# EasyEDA Pro project CH585M-R1(3)(1)(5).eprj, schematic Schematic1
Board Name: Key; Create Date: 2025-06-08; Page Name: P1; Project Name: CH585M-R1; Schematic Name: Schematic1; Update Date: 2025-06-08; Company: 嘉立创EDA; Page Size: A4; Version: V1.0
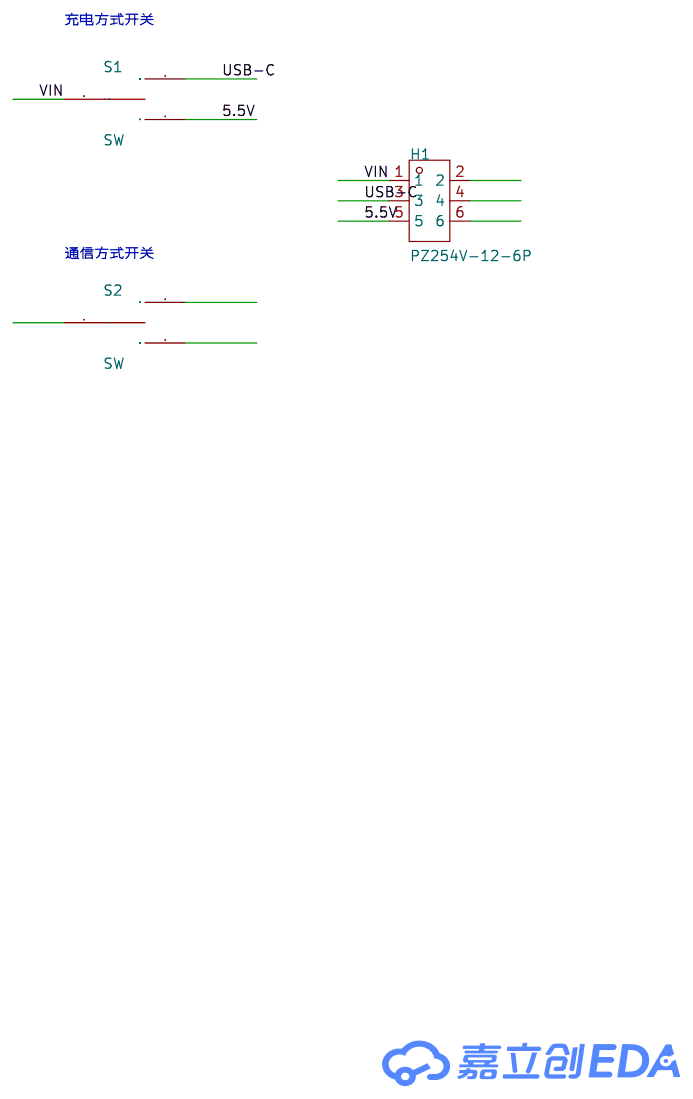
[diagram p2: schematic sheet]

## Parts
H1  PZ254V-12-6P  [HDR-TH_6P-P2.54-V-M-R2-C3-S2.54]
S1  SW  [SW1]
S2  SW  [SW1]

## Library data of the parts
H1 = PZ254V-12-6P: 插针结构:2x3P;间距:2.54mm;行距:2.54mm;圆针/方针:方针;安装类型:直插;排数:双排;总PIN位数:6P;额定电流:-;额定电压:-;配合针长度:6mm;塑高:2.5mm;端接针长度:3mm;触头材质:黄铜;触头镀层:-;工作温度范围:-40℃~+105℃;颜色:黑色;; LCSC Part Name: 间距:2.54mm 2x3P 直插 方针; Supplier Part: C492420; Manufacturer: XFCN(兴飞); Supplier Footprint: 插件,P=2.54mm; JLCPCB Part Class: 扩展库; Datasheet: https://atta.szlcsc.com/upload/public/pdf/source/20200309/C492420_BAECB307B001054C09D200388220EAE6.pdf; Supplier: LCSC; Pin Structure: 2x3P; Pitch: 2.54mm; Row Spacing: 2.54mm; Circluar Pins/Square Pins: 方针; Mounting Type: 直插; Number of Rows: 双排; Number of Pins: 6P; Length of Mating Pin: 6mm; Insulation Height: 2.5mm; Length of End Connection Pin: 3mm; Contact Material: 黄铜; Operating Temperature Range: -40℃~+105℃; Color: 黑色
S1 S2 = SW: Library Name: MYSCH

## Nets
5.5V: H1.5 S1.2
VIN: H1.1 S1.1
USB-C: H1.3 S1.3

Not connected (* = marked no-connect by the designer): H1 2 4 6; S2 1 2 3

## Notes on the sheet
- 充电方式开关
- 通信方式开关
